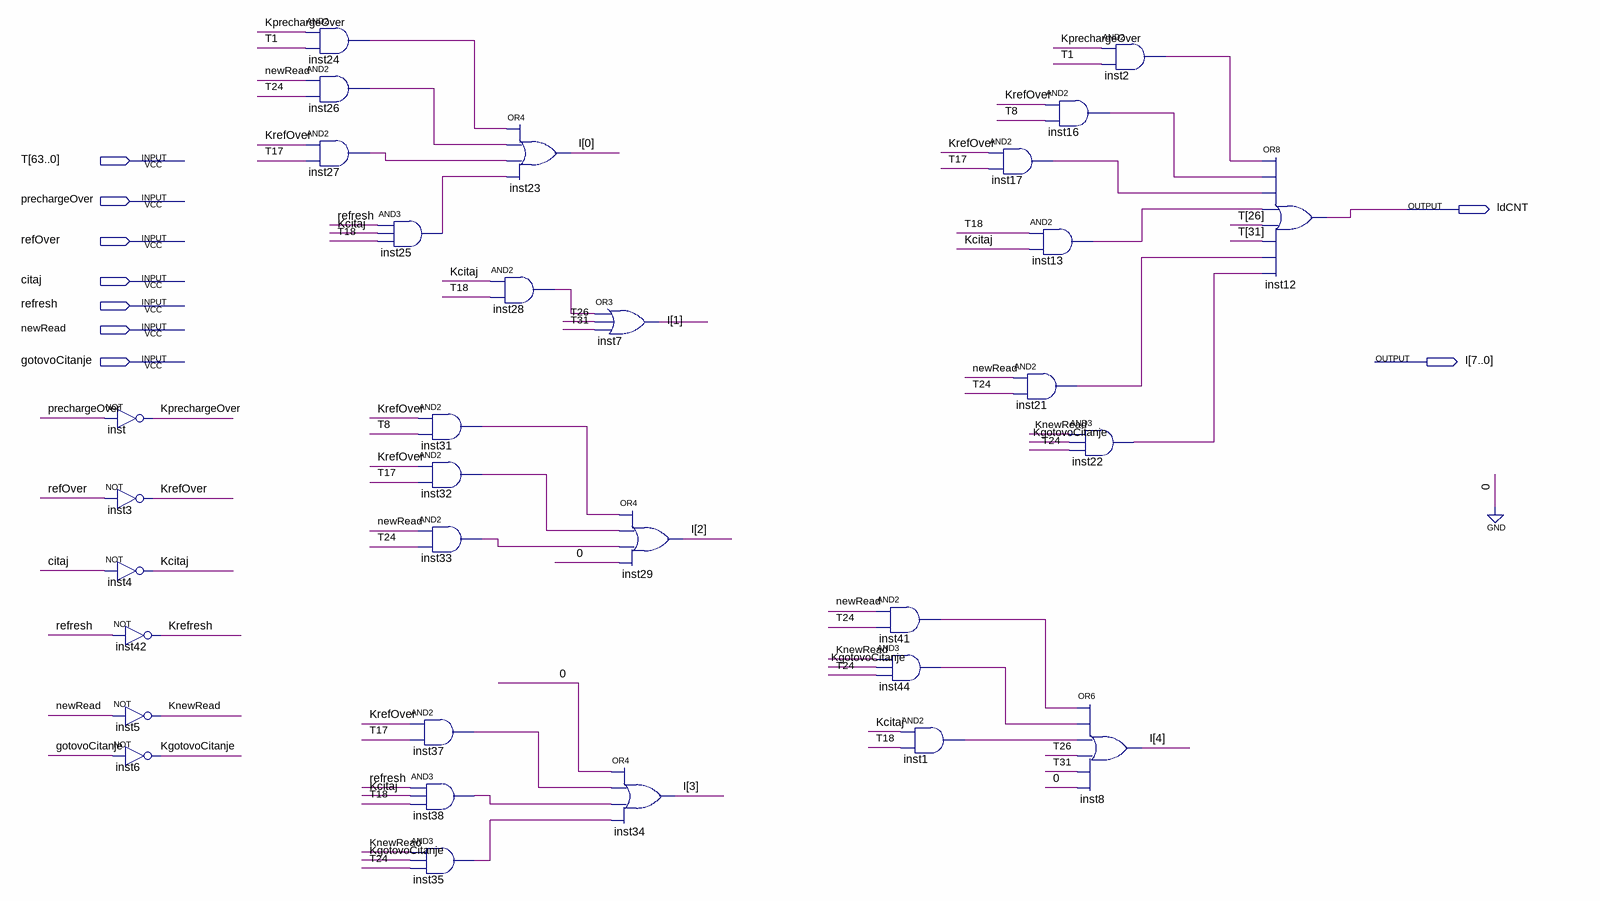
[diagram p0: schematic sheet]
// Quartus schematic UpravljackiSignali.bdf as structural Verilog: 32 symbols, 9 pins
module UpravljackiSignali (
  input  [63:0] T,
  input  prechargeOver,
  input  refOver,
  input  citaj,
  input  refresh,
  input  newRead,
  input  gotovoCitanje,
  output ldCNT,
  output [7:0] I
);

  wire inst1_out, inst2_out, inst13_out, inst16_out, inst17_out, inst21_out, inst22_out, inst24_out,
       inst25_out, inst26_out, inst27_out, inst28_out, inst31_out, inst32_out, inst33_out, inst35_out,
       inst37_out, inst38_out, inst41_out, inst44_out, Kcitaj, KgotovoCitanje, KnewRead, KprechargeOver,
       KrefOver, Krefresh;

  not inst (KprechargeOver, prechargeOver);
  not inst3 (KrefOver, refOver);
  not inst4 (Kcitaj, citaj);
  not inst42 (Krefresh, refresh);
  not inst5 (KnewRead, newRead);
  not inst6 (KgotovoCitanje, gotovoCitanje);
  and inst24 (inst24_out, KprechargeOver, T[1]);
  and inst26 (inst26_out, newRead, T[24]);
  and inst27 (inst27_out, KrefOver, T[17]);
  and inst25 (inst25_out, refresh, Kcitaj, T[18]);
  and inst31 (inst31_out, KrefOver, T[8]);
  and inst32 (inst32_out, KrefOver, T[17]);
  and inst33 (inst33_out, newRead, T[24]);
  and inst37 (inst37_out, KrefOver, T[17]);
  and inst38 (inst38_out, refresh, Kcitaj, T[18]);
  and inst35 (inst35_out, KnewRead, KgotovoCitanje, T[24]);
  or inst23 (I[0], inst24_out, inst26_out, inst27_out, inst25_out);
  and inst28 (inst28_out, Kcitaj, T[18]);
  or inst7 (I[1], inst28_out, T[26], T[31]);
  or inst29 (I[2], inst31_out, inst32_out, inst33_out, 1'b0);
  or inst34 (I[3], 1'b0, inst37_out, inst38_out, inst35_out);
  and inst41 (inst41_out, newRead, T[24]);
  and inst44 (inst44_out, KnewRead, KgotovoCitanje, T[24]);
  and inst1 (inst1_out, Kcitaj, T[18]);
  and inst17 (inst17_out, KrefOver, T[17]);
  and inst21 (inst21_out, newRead, T[24]);
  and inst16 (inst16_out, KrefOver, T[8]);
  and inst13 (inst13_out, T[18], Kcitaj);
  and inst22 (inst22_out, KnewRead, KgotovoCitanje, T[24]);
  or inst8 (I[4], inst41_out, inst44_out, inst1_out, T[26], T[31], 1'b0);
  and inst2 (inst2_out, KprechargeOver, T[1]);
  or inst12 (ldCNT, inst2_out, inst16_out, inst17_out, inst13_out, T[26], T[31], inst21_out, inst22_out);
endmodule
